# EAGLE design TFTBR (EAGLE 9.6.2)
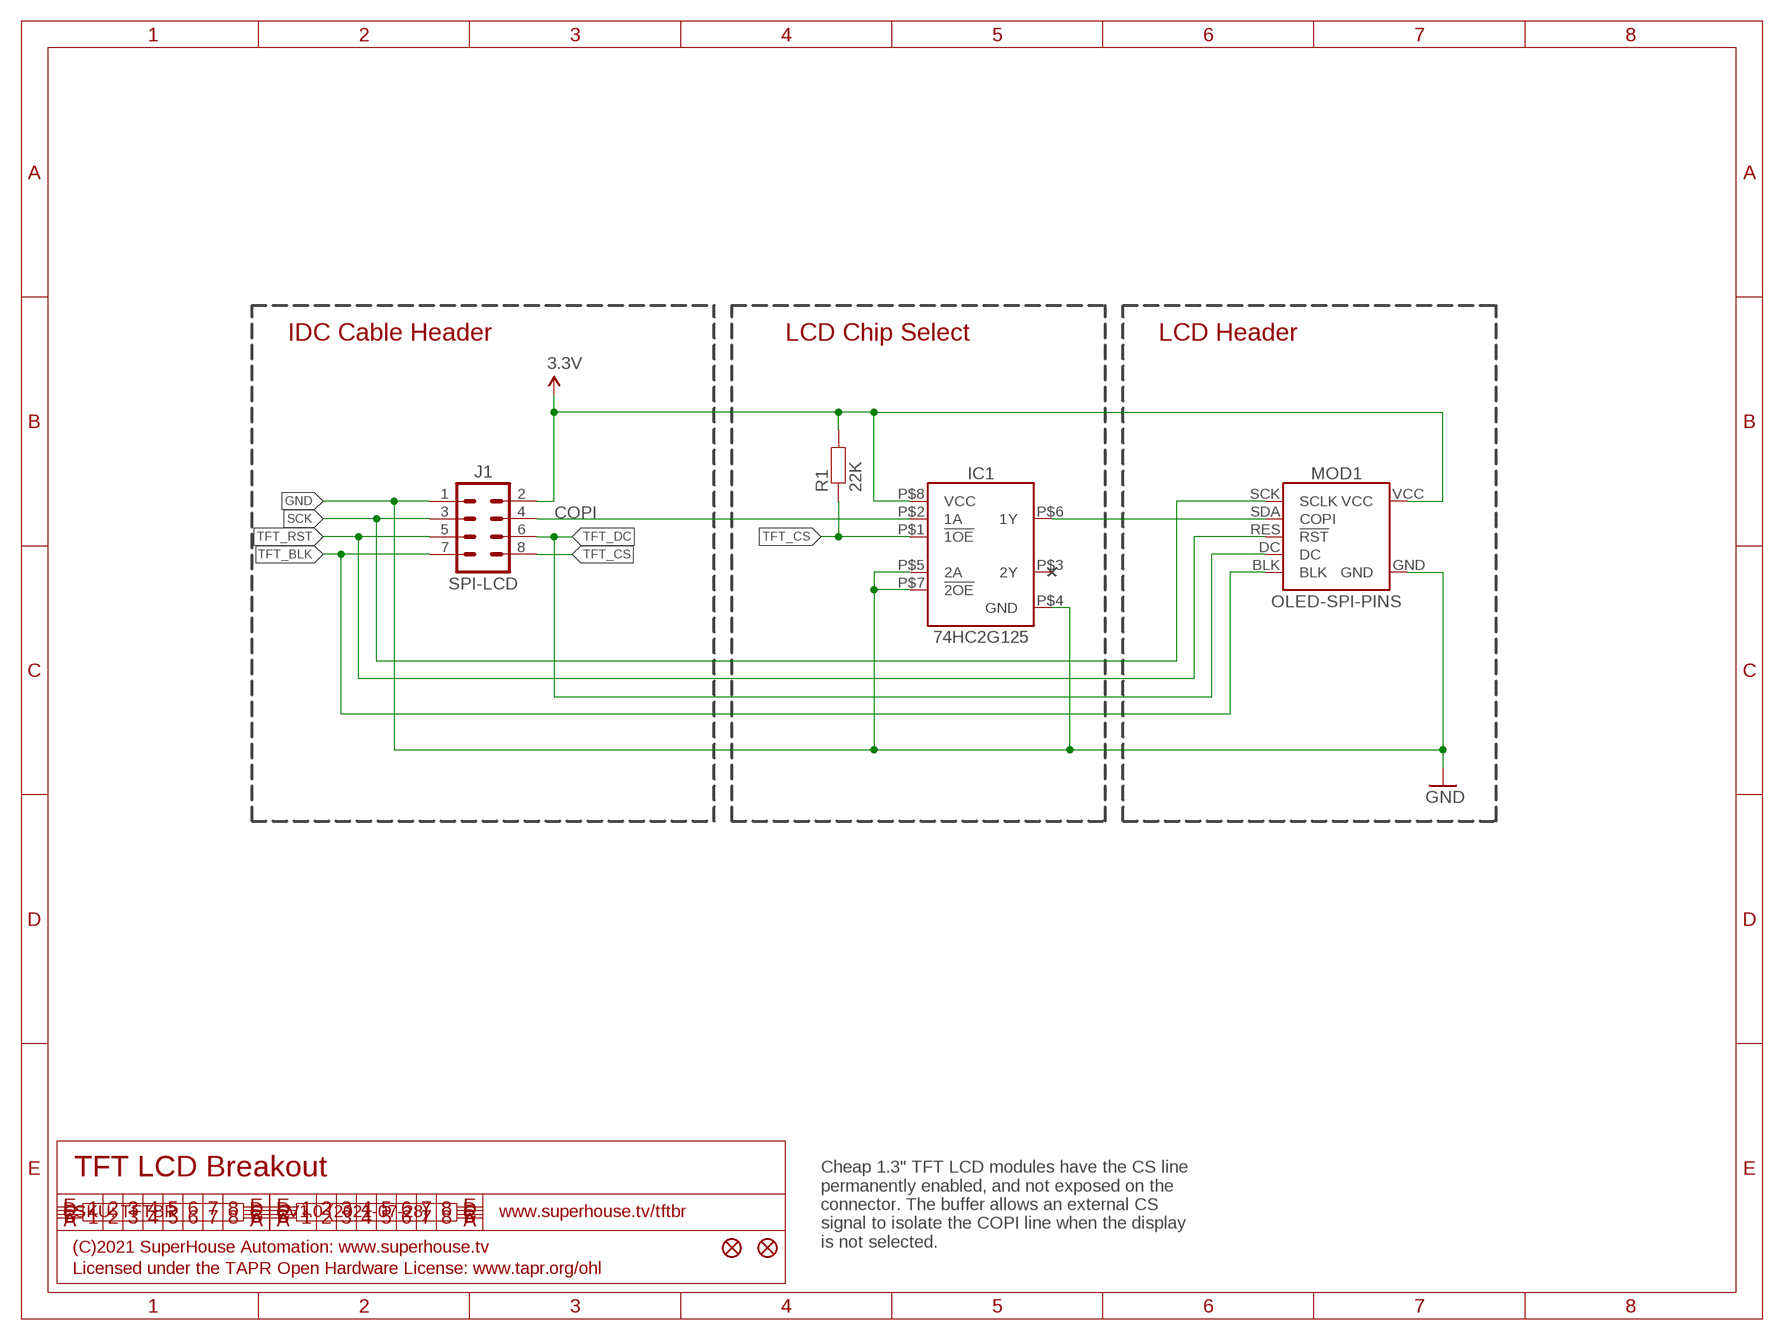
[diagram p0: schematic, sheet 1]

## Parts
FID1  FIDUCIAL1X2.5  [FIDUCIAL-1X2.5]
FID2  FIDUCIAL1X2.5  [FIDUCIAL-1X2.5]
IC1  74HC2G125  74HC2G125-TSSOP8  [74HC2G125]
J1  SPI-LCD  M02X4-SHROUD  [2X04-2.54-SHROUDED]
MOD1  OLED-SPI-PINS  [OLED-240X240-1.3]
R1  22K  RESISTOR0603  [R0603]

## Nets
3.3V: IC1.P$8(VCC) J1.2 MOD1.VCC R1.2
COPI: IC1.P$2(1A) J1.4
GND: IC1.P$4(GND) IC1.P$5(2A) IC1.P$7(!2OE) J1.1 MOD1.GND
N$1: IC1.P$6(1Y) MOD1.SDA(COPI)
SCK: J1.3 MOD1.SCK(SCLK)
TFT_BLK: J1.7 MOD1.BLK
TFT_CS: IC1.P$1(!1OE) J1.8 R1.1
TFT_DC: J1.6 MOD1.DC
TFT_RST: J1.5 MOD1.RES(!RST)
Unconnected: IC1.P$3(2Y)

## Notes on the sheet
- IDC Cable Header | LCD Chip Select | LCD Header
- TFT LCD Breakout
- SKU: TFTBR | V1.0 (2021-07-28) | www.superhouse.tv/tftbr
- Cheap 1.3" TFT LCD modules have the CS line
  permanently enabled, and not exposed on the
  connector. The buffer allows an external CS
  signal to isolate the COPI line when the display
  is not selected.
- (C)2021 SuperHouse Automation: www.superhouse.tv
- Licensed under the TAPR Open Hardware License: www.tapr.org/ohl

## Library data of the parts
FID1 FID2 = SuperHouse-Symbols:FIDUCIAL: Fiducial Alignment Points Various fiducial points for machine vision alignment.
IC1 = SuperHouse-ICs:74HC2G125: 74HC2G125 tri-state dual buffer
J1 = SuperHouse-Connectors:M02X4: M08 header in 2x4 format
MOD1 = SuperHouse-Displays:OLED-SPI
R1 = SuperHouse-Resistors:RESISTOR: Resistors in both surface-mount and through-hole versions.

## Board
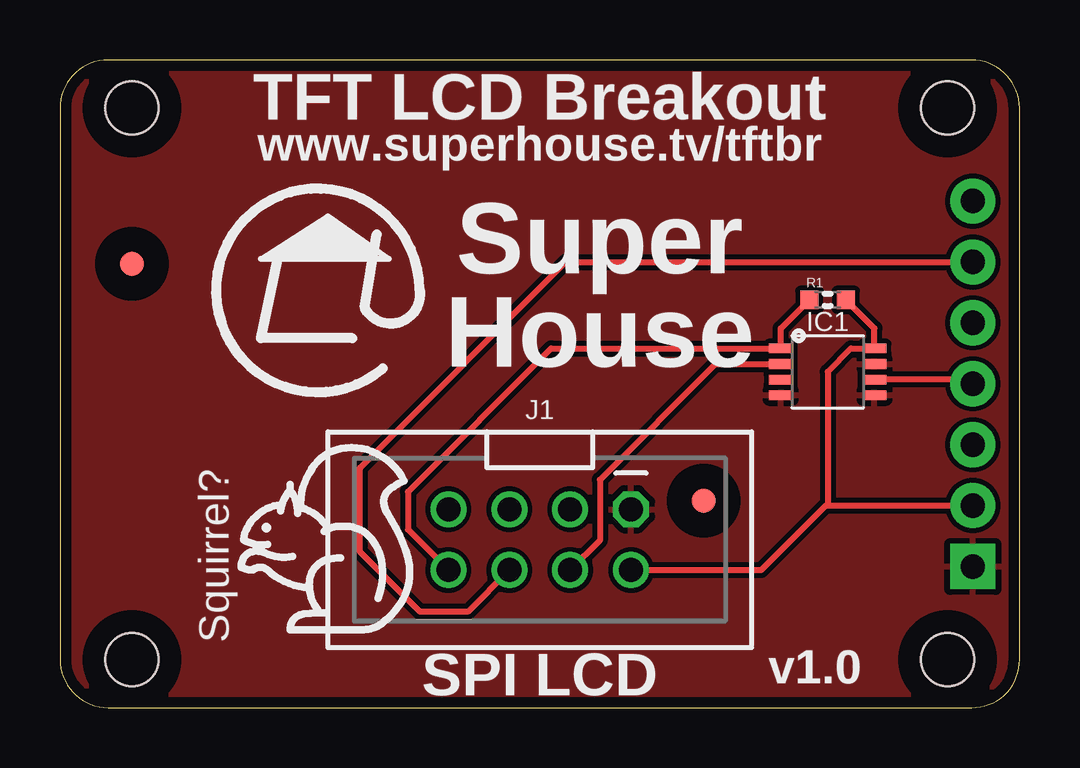
[diagram p1: board, top side]
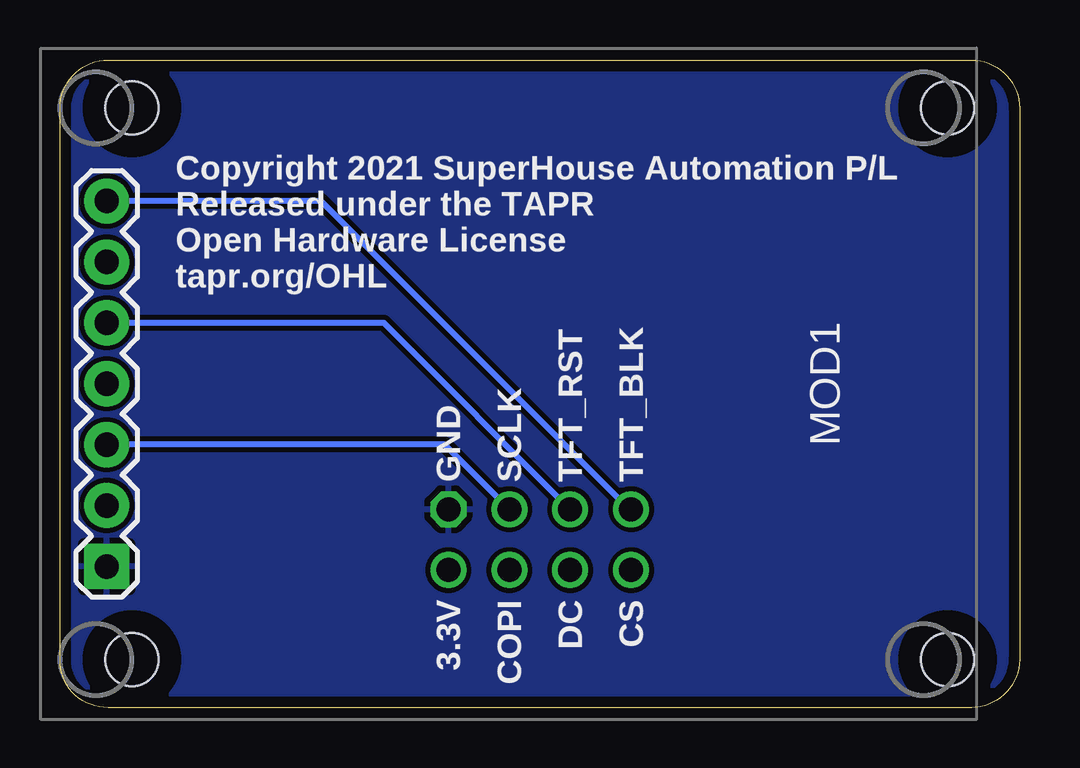
[diagram p2: board, bottom side, seen from below]

Size 40 x 27 mm. Coordinates in mm from the lower left corner, seen from the top.
Outline: 40,25 arc90 38,27 2,27 arc90 0,25 0,2 arc90 2,0 38,0 arc92 40,2 40,25
Copper layers (1*16): Top 0.035mm / dielectric 1.5mm / Bottom 0.035mm
Design rules "SuperHouse-Design-Rules *": minimum track width 10mil, minimum drill 24mil, track to track 8mil, track to pad 8mil, pad to pad 8mil, via to via 8mil, smd to smd 6mil, copper to edge 18mil, drill to drill 8mil, minimum pad ring 7mil, minimum via ring 8mil, stop-mask expansion 4mil, vias tented up to drill 0.5mm, thermal gap 10mil
Holes 2.2 mm at 37,2 37,25 3,2 3,25
tRestrict: area 2,17.5 to 4,19.5; area 25.8,7.6 to 27.8,9.6; area 35,23 to 39,27; area 35,0 to 39,4; area 1,0 to 5,4; area 1,23 to 5,27
bRestrict: area 35,23 to 39,27; area 35,0 to 39,4; area 1,23 to 5,27; area 1,0 to 5,4

### Footprints (pad centres in the part's own frame; a part is rotated, then mirrored left to right if it is on the bottom)
FIDUCIAL-1X2.5 = smd 1 x 1: 1 0,0
74HC2G125 = smd 1 x 0.4: P$1 -1.95,0.975; P$2 -1.95,0.325; P$3 -1.95,-0.325; P$4 -1.95,-0.975; P$5 1.95,-0.975; P$6 1.95,-0.325; P$7 1.95,0.325; P$8 1.95,0.975
2X04-2.54-SHROUDED = drill 1 octagon: 1 -3.81,-1.27 | drill 1: 2 -3.81,1.27; 3 -1.27,-1.27; 4 -1.27,1.27; 5 1.27,-1.27; 6 1.27,1.27; 7 3.81,-1.27; 8 3.81,1.27
OLED-240X240-1.3 = drill 1.016 pad 1.88: BLK 7.62,14.75; DC 5.08,14.75; RES 2.54,14.75; SCK -2.54,14.75; SDA 0,14.75; VCC -5.08,14.75 | drill 1.016 pad 1.88 square: GND -7.62,14.75
R0603 = smd 0.762 x 0.762: 1 -0.762,0; 2 0.762,0

### Placement (x,y rotation side)
FID1  3,18.5 180 top
FID2  26.83,8.62 180 top
IC1  32,14 0 top
J1  20,7 180 top
MOD1  23.3,13.5 90 bottom
R1  32,17 0 top

### Tracks (layer width: path | path; a pad name or v marks a point on that pad's centre or on a via)
3.3V
  Top 0.254: R1.2 33.95,15.81 IC1.P$8 32.98,14.97 32,14 32,8.42 | 32,8.42 31.92,8.42 29.23,5.73 J1.2 | 32,8.42 MOD1.VCC
COPI
  Top 0.254: IC1.P$2 27.32,14.32 22.5,9.5 22.5,6.96 J1.4
GND
  pour Bottom: 40,2 arc-90 38,0 2,0 arc-90 0,2 0,25 arc-90 2,27 38,27 arc-90 40,25
  pour Top: 40,2 arc-90 38,0 2,0 arc-90 0,2 0,25 arc-90 2,27 38,27 arc-90 40,25
N$1
  Top 0.254: MOD1.SDA 37.58,13.68 IC1.P$6
SCK
  Bottom 0.254: J1.3 23.96,10.96 MOD1.SCK
TFT_BLK
  Bottom 0.254: MOD1.BLK 29.12,21.12 16.27,8.27 J1.7
TFT_CS
  Top 0.254: R1.1 30.05,15.81 IC1.P$1 20.48,14.97 14.5,9 14.5,7.42 J1.8
TFT_DC
  Top 0.254: J1.6 17,4 15,4 12.5,6.5 12.5,10 21.08,18.58 MOD1.DC
TFT_RST
  Bottom 0.254: J1.5 26.5,16.04 MOD1.RES

### Text on the board
tPlace: TFT LCD Breakout | www.superhouse.tv/tftbr | Super / House | Squirrel? | v1.0 | SPI LCD
bPlace: Copyright 2021 SuperHouse Automation P/L / Released under the TAPR / Open Hardware License / tapr.org/OHL | TFT_BLK | TFT_RST | SCLK | GND | CS | DC | COPI | 3.3V
Measures: TFTBR v1.0 Dimensions (mm)